# Altium project DIINProject.PrjPcb
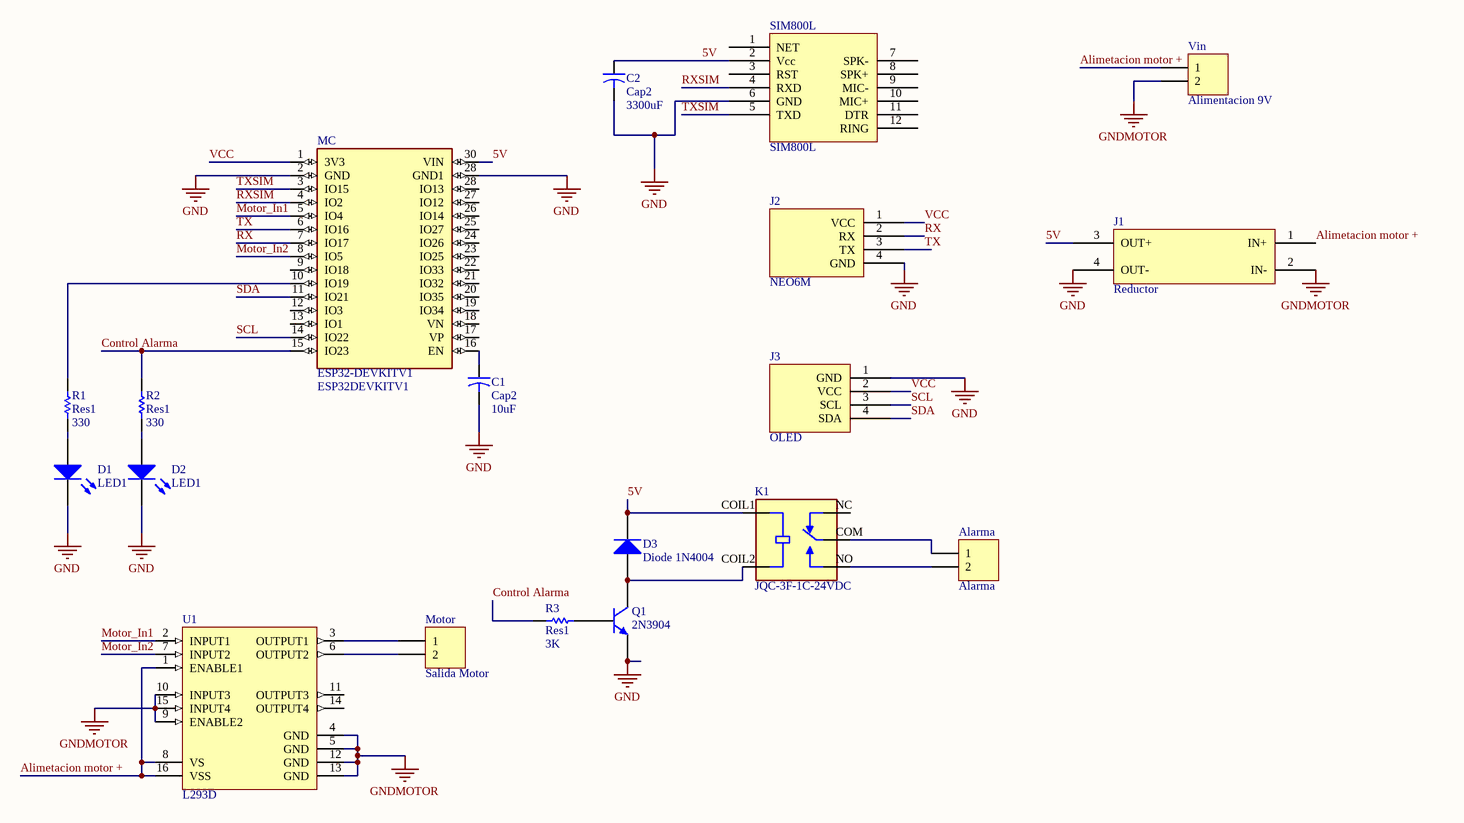
[diagram p0: DIINproject.SchDoc]
1 sheet, 19 parts. Net scope: global (net labels, ports and power ports of the same name join across sheets).
Board file: DIINproject.PcbDoc

## Sheet DIINproject.SchDoc
size B; SheetNumber: 1; SheetTotal: 1

### Parts
Alarma  Alarma  [HDR1X2]
C1  Cap2  value 10uF  [CAPR5-4X5]
C2  Cap2  value 3300uF  [CAPR5-4X5]
D1  LED1  [LED-1]
D2  LED1  [LED-1]
D3  Diode 1N4004  [DO-41]
J1  Reductor  [Reductor]
J2  NEO6M  [NEO6M]
J3  OLED  [OLED]
K1  JQC-3F-1C-24VDC  [RELAY_JQC-3F-1C-24VDC]
MC  ESP32DEVKITV1  [ESP32-DEVKITV1_3D]
Motor  Salida Motor  [HDR1X2]
Q1  2N3904  [TO-92A]
R1  Res1  value 330  [AXIAL-0.3]
R2  Res1  value 330  [AXIAL-0.3]
R3  Res1  value 3K  [AXIAL-0.3]
SIM800L  SIM800L  [SIM800L]
U1  L293D  [STM-L293D-16]
Vin  Alimentacion 9V  [HDR1X2]

### Nets
GND: C1.2 C2.2 D1.2(K) D2.2(K) J1.4(OUT-) J2.4(GND) J3.1(GND) MC.2(GND) MC.28(IO13) Q1.1(E) SIM800L.6(GND)
GNDMOTOR: J1.2(IN-) U1.4(GND) U1.5(GND) U1.9(ENABLE2) U1.10(INPUT3) U1.12(GND) U1.13(GND) U1.15(INPUT4) Vin.2
5V: C2.1 D3.2(K) J1.3(OUT+) K1.COIL1 MC.30(VIN) SIM800L.2(Vcc)
Alimetacion motor +: J1.1(IN+) U1.1(ENABLE1) U1.8(VS) U1.16(VSS) Vin.1
Control Alarma: MC.15(IO23) R2.1 R3.1
Motor_In1: MC.5(IO4) U1.2(INPUT1)
Motor_In2: MC.8(IO5) U1.7(INPUT2)
RX: J2.2(RX) MC.7(IO17)
RXSIM: MC.4(IO2) SIM800L.4(RXD)
SCL: J3.3(SCL) MC.14(IO22)
SDA: J3.4(SDA) MC.11(IO21)
TX: J2.3(TX) MC.6(IO16)
TXSIM: MC.3(IO15) SIM800L.5(TXD)
VCC: J2.1(VCC) J3.2(VCC) MC.1(3V3)
NetAlarma_1: Alarma.1 K1.COM
NetAlarma_2: Alarma.2 K1.NO
NetC1_1: C1.1 MC.16(EN)
NetD1_1: D1.1(A) R1.1
NetD2_1: D2.1(A) R2.2
NetD3_1: D3.1(A) K1.COIL2 Q1.3(C)
NetMC_10: MC.10(IO19) R1.2
NetMotor_1: Motor.1 U1.3(OUTPUT1)
NetMotor_2: Motor.2 U1.6(OUTPUT2)
NetQ1_2: Q1.2(B) R3.2

Not connected (* = marked no-connect by the designer): K1 NC; MC 9(IO18) 12(IO3) 13(IO1) 17(VP) 18(VN) 19(IO34) 20(IO35) 21(IO32) 22(IO33) 23(IO25) 24(IO26) 25(IO27) 26(IO14) 27(IO12); SIM800L 1(NET) 3(RST) 7(SPK-) 8(SPK+) 9(MIC-) 10(MIC+) 11(DTR) 12(RING); U1 11(OUTPUT3) 14(OUTPUT4)

### Notes on the sheet
- (in symbol ESP32DEVKITV1) ESP32-DEVKITV1

### Library data of the parts
Alarma Motor Vin = Header 2: Header, 2-Pin; LatestRevisionDate: 17-Jul-2002; LatestRevisionNote: Re-released for DXP Platform.; Publisher: Altium Limited
C1 C2 = Cap2: Capacitor; Published: 23-Sep-2002; PackageReference: CAPR5-4X5; Publisher: Altium Limited; PackageDescription: Capacitor; 2 Leads
D1 D2 = LED1: Typical RED GaAs LED; Published: 8-Jun-2000; LatestRevisionDate: 08-Jul-2005; LatestRevisionNote: Mech Layer 1 removed.; PackageReference: LED-1; Publisher: Altium Limited; PackageDescription: LED; 2 Leads
D3 = Diode 1N4004: 1 Amp General Purpose Rectifier; Published: 8-Jun-2000; LatestRevisionDate: 17-Jul-2002; LatestRevisionNote: Re-released for DXP Platform.; DatasheetVersion: 1998; PackageVersion: Aug-1999; PackageReference: DO-41; Publisher: Altium Limited; PackageDescription: Diode, Axial; Body 5.2 x 2.7 mm (LxDia. max), Lead Dia. 0.86 mm (max); Code_JEDEC: DO-204-AL; ComponentLink1Description: Manufacturer Link; ComponentLink1URL: http://www.fairchildsemi.com/; ComponentLink2Description: Datasheet; ComponentLink2URL: http://www.fairchildsemi.com/ds/1N%2F1N4001.pdf
K1 = JQC-3F-1C-24VDC: Miniature PCB Relay 24VDC, 10A 250VAC, 15A 125VAC, 10A 250VAC; MF: YUEQING HENGWEI ELECTRONICS CO.,LTD.; Price: None; MP: JQC-3F-1C-24VDC; Availability: Unavailable; SnapEDA_Link: https://www.snapeda.com/parts/JQC-3F-1C-24VDC/YUEQING%20HENGWEI%20ELECTRONICS%20CO.,LTD./view-part/4374405/?ref=snap; Value: *; Package: Package; Check_prices: https://www.snapeda.com/parts/JQC-3F-1C-24VDC/YUEQING%20HENGWEI%20ELECTRONICS%20CO.,LTD./view-part/4374405/?ref=eda
MC = ESP32DEVKITV1: Dual core, Wi-Fi: 2.4 GHz up to 150 Mbits/s,BLE (Bluetooth Low Energy) and legacy Bluetooth, 32 bits, Up to 240 MHz; MF: Do it; Check_prices: https://www.snapeda.com/parts/ESP32%20DEVKIT%20V1/Do%20it/view-part/5659245/?ref=eda; Value: *; SnapEDA_Link: https://www.snapeda.com/parts/ESP32%20DEVKIT%20V1/Do%20it/view-part/5659245/?ref=snap; Package: Package; Availability: Unavailable; Price: None; MP: ESP32 DEVKIT V1
Q1 = 2N3904: NPN General Purpose Amplifier; Published: 8-Jun-2000; LatestRevisionDate: 15-Jan-2003; LatestRevisionNote: PCB Footprint 'BCY-W3/D4.7' replaced; DatasheetVersion: 1997; PackageVersion: Sep-1998; PackageReference: TO-92A; Publisher: Altium Limited; PackageDescription: TO, Flat Index; 3 In-Line, Axial Leads; Body Dia. 4.5mm; Leads 0.51 x 0.48 mm (max); ComponentLink1Description: Manufacturer Link; ComponentLink1URL: http://www.fairchildsemi.com/; ComponentLink2Description: Datasheet; ComponentLink2URL: http://www.fairchildsemi.com/ds/2N%2F2N3904.pdf
R1-R3 = Res1: Resistor; Published: 8-Jun-2000; LatestRevisionDate: 17-Jul-2002; LatestRevisionNote: Re-released for DXP Platform.; PackageReference: AXIAL-0.3; Publisher: Altium Limited; PackageDescription: Axial Device, Thru-Hole; 2 Leads; 0.3 in Pin Spacing
U1 = CMP-2000-06524-1: Push-Pull Four Channel Driver with Diode, 4.5 to 36 V, -40 to 150 degC, 16-Pin PDIP, RoHS, Tube; Manufacturer: STMicroelectronics; Number of Outputs: 4; Current - Peak Output: 1.2A; Current - Output / Channel: 600mA; Input Type: Non-Inverting; Other Related Documents: L293DViewAllSpecifications; Dynamic Catalog: HalfBridge; Voltage - Supply: 4.5V~36V; Other Names: 497-2936-5; Package / Case: 16-DIP(0.300",7.62mm); PartNumber: L293D; Operating Temperature: -40°C~150°C; Datasheet URL: http://www.st.com/st-web-ui/static/active/en/resource/technical/document/datasheet/CD00000059.pdf; Supplier Device Package: 16-PowerDIP; Packaging: Tube; Package Description: 16-Pin Thru-Hole Dual-In-Line, Body 20 x 6.85 mm, Pitch 2.54 mm; Standard Package: 25; Datasheet Version: 07/2003; On-State Resistance: -; Manufacturer URL: http://www.st.com/; Category: IntegratedCircuits(ICs); Family: PMIC-MOSFET,BridgeDrivers-InternalSwitch; Type: HalfBridge; Series: -; Mounting Technology: ThroughHole; Package Reference: DIP-16; Mounting Type: ThroughHole